# Altium schematic sheet [5]Motor_Driver.SchDoc
size A3; DocumentNumber: 5; SheetNumber: 5; SheetTotal: 11
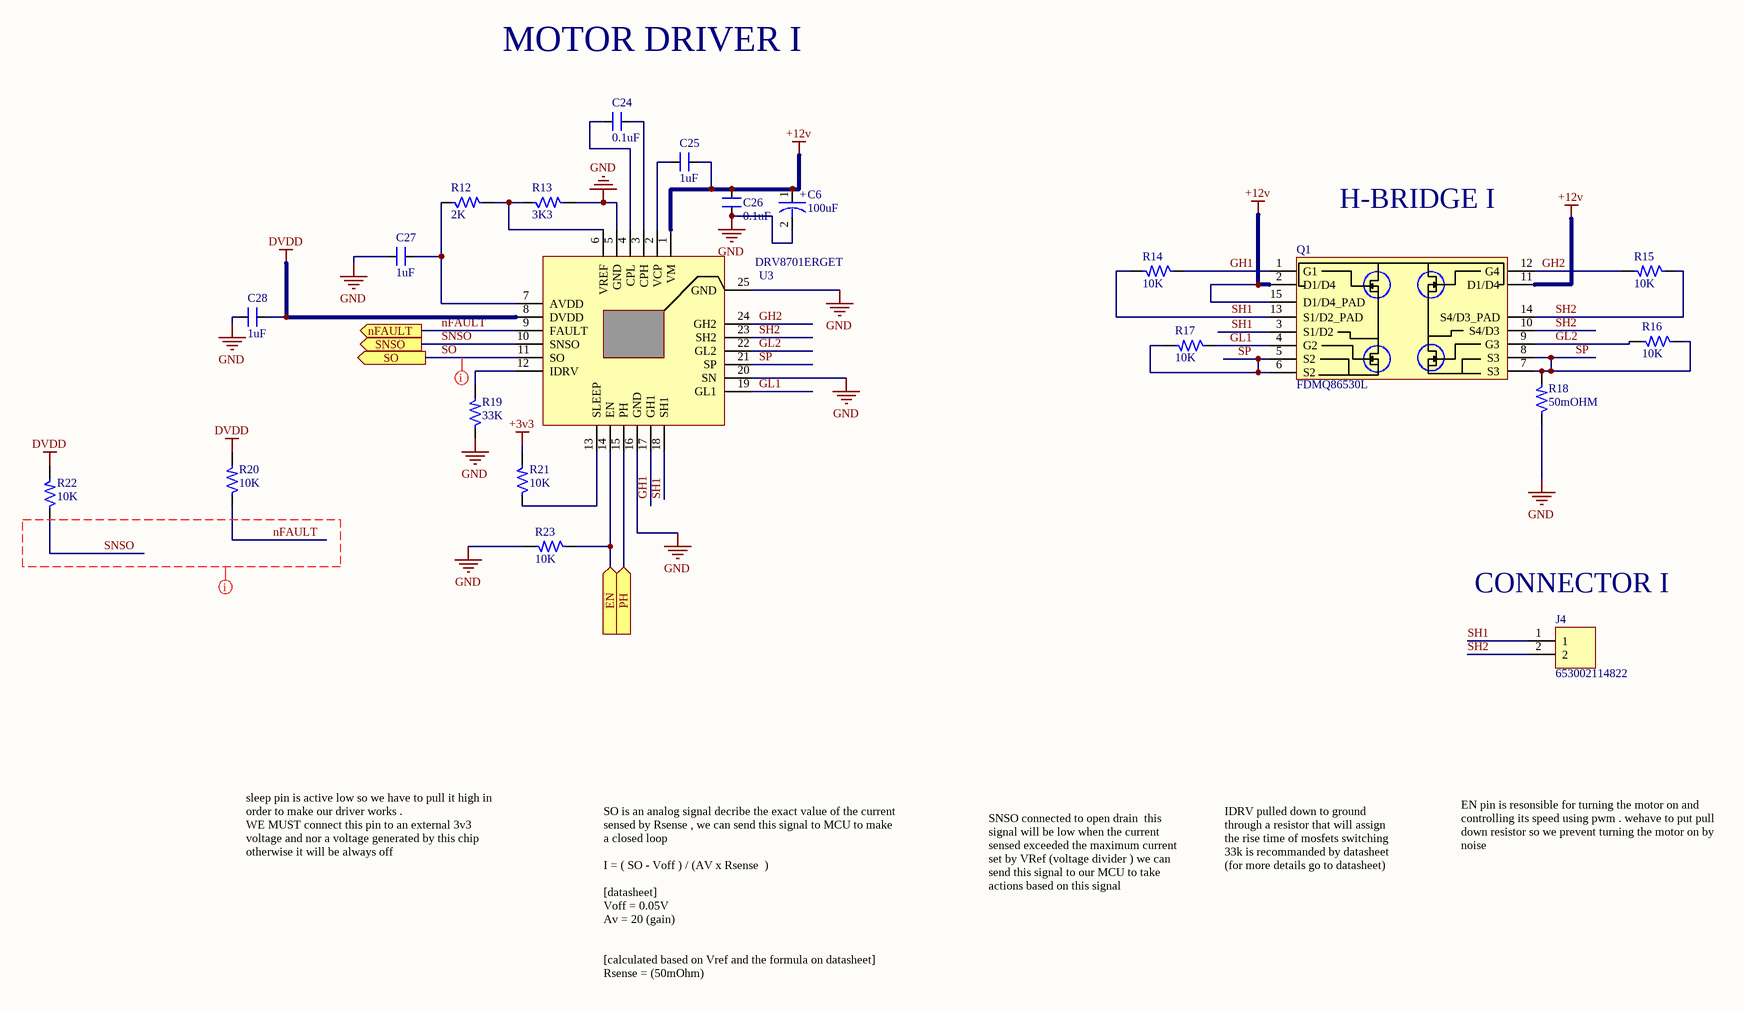
[diagram p0: [5]Motor_Driver.SchDoc]

## Parts
C6  100uF  [ACAP_P305_D393_H393_RAD]
C24  0.1uF  [CAP_0805]
C25  1uF  [CAP_0805]
C26  0.1uF  [CAP_0805]
C27  1uF  [CAP_0805]
C28  1uF  [CAP_0805]
J4  653002114822  [CON2_50_653002114822_TH_ST]
Q1  FDMQ86530L  [DFN5045-12_33_212_27X15_SMD_1]
R12  2K  [RES_0805]
R13  3K3  [RES_0603]
R14  10K  [RES_0805]
R15  10K  [RES_0805]
R16  10K  [RES_0805]
R17  10K  [RES_0805]
R18  50mOHM  [RES_2512]
R19  33K  [RES_0805]
R20  10K  [RES_0805]
R21  10K  [RES_0805]
R22  10K  [RES_0805]
R23  10K  [RES_0805]
U3  DRV8701ERGET  [VFQFN24_19.6_196_12X32_SMD_1]

## Ports
EN (in), nFAULT (out), PH (in), SNSO (out), SO (out)

## Nets
+3v3: R21.2
+12v: C6.1 C25.2 C26.2 Q1.2(D1/D4) Q1.11(D1/D4) Q1.15(D1/D4_PAD) U3.1(VM)
DVDD: C28.2 R20.2 R22.2 U3.8(DVDD)
GND: C6.2 C26.1 C27.1 C28.1 R13.2 R18.1 R19.1 R23.2 U3.5(GND) U3.16(GND) U3.20(SN) U3.25(GND)
EN: R23.1 U3.14(EN) ; port EN
GH1: Q1.1(G1) R14.1 U3.17(GH1)
GH2: Q1.12(G4) R15.2 U3.24(GH2)
GL1: Q1.4(G2) R17.1 U3.19(GL1)
GL2: Q1.9(G3) R16.2 U3.22(GL2)
nFAULT: R20.1 U3.9(FAULT) ; port nFAULT
PH: U3.15(PH) ; port PH
SH1: J4.1 Q1.3(S1/D2) Q1.13(S1/D2_PAD) R14.2 U3.18(SH1)
SH2: J4.2 Q1.10(S4/D3) Q1.14(S4/D3_PAD) R15.1 U3.23(SH2)
SNSO: R22.1 U3.10(SNSO) ; port SNSO
SO: U3.11(SO) ; port SO
SP: Q1.5(S2) Q1.6(S2) Q1.7(S3) Q1.8(S3) R16.1 R17.2 R18.2 U3.21(SP)
NetC24_1: C24.1 U3.4(CPL)
NetC24_2: C24.2 U3.3(CPH)
NetC25_1: C25.1 U3.2(VCP)
NetC27_2: C27.2 R12.1 U3.7(AVDD)
NetR12_2: R12.2 R13.1 U3.6(VREF)
NetR19_2: R19.2 U3.12(IDRV)
NetR21_1: R21.1 U3.13(SLEEP)

## Layout directives
net class Critical nets: nFAULT, SNSO, SO

## Notes on the sheet
- MOTOR DRIVER I
- H-BRIDGE I
- (near J4) CONNECTOR I
- sleep pin is active low so we have to pull it high in order to make our driver works .
  WE MUST connect this pin to an external 3v3 voltage and nor a voltage generated by this chip otherwise it will be always off
- SNSO connected to open drain  this signal will be low when the current sensed exceeded the maximum current set by VRef (voltage divider ) we can send this signal to our MCU to take actions based on this signal
- IDRV pulled down to ground through a resistor that will assign the rise time of mosfets switching
  33k is recommanded by datasheet
  (for more details go to datasheet)
- EN pin is resonsible for turning the motor on and controlling its speed using pwm . wehave to put pull down resistor so we prevent turning the motor on by noise
- SO is an analog signal decribe the exact value of the current  sensed by Rsense , we can send this signal to MCU to make a closed loop
  I = ( SO - Voff ) / (AV x Rsense  )
  [datasheet]
  Voff = 0.05V
  Av = 20 (gain)
  [calculated based on Vref and the formula on datasheet]
  Rsense = (50mOhm)
- Title
- Size:
- Date:
- A3
- Number:
- Time:
- Revision:
- Sheet
- of
- File:
- (in symbol CAP-P_100uF-50V-20%-RAD) +

## Library data of the parts
C6 = CAP-P_100uF-50V-20%-RAD: 100µF 50V Aluminum Polymer Capacitor Radial, Can - SMD 28mOhm 4000 Hrs @ 125°C /; Manufacturer: Nichicon; Manufacturer Part Number: GYA1H101MCQ1GS; Alternate Part Number-1: VEU101M1HTR-1010; Case/Package: Radial-SMD; Supplier-1: SP ROAD; Supplier Part Number-1: GYA1H101MCQ1GS
C24 C26 = CAP_0.1uF-50V-5%-0805: 0.1µF ±5% 50V Ceramic Capacitor X7R 0805 (2012 Metric) /; Manufacturer: AVX Corporation; Manufacturer Part Number: 08055C104JAT4A; Alternate Part Number-1: 0805B104M500; Case/Package: 0805; Supplier-1: SIRICOM; Supplier Part Number-1: 0805B104J500CT
C25 C27 C28 = CAP_1uF-50V-5%-0805: 1µF ±5% 50V Ceramic Capacitor X7R 0805 (2012 Metric) /; Manufacturer: Samsung; Manufacturer Part Number: CC0805JKX7R9BB105; Alternate Part Number-1: 0805F105M500NT; Case/Package: 0805; Supplier-1: SIRICOM; Supplier Part Number-1: CL21B105KBFNNNE
J4 = CON-PLG_2X1-50-ST-TH: 2 Pins, 1 Row 1.25mm Pitch, Straight Connector, male; Manufacturer: JST; Mating Part Number: 653002113322; Crimp Part Number: 653153128130; Alternate Part Number-1: NA; Manufacturer Part Number: 653002114822; Case/Package: TH-CON; Supplier-1: WURTH; Supplier Part Number-1: 653002114822
Q1 = MOSFET-N_60V-8A-V-DFN5045-12: Mosfet Array 4 N-Channel 8A (Ta) Surface Mount V-DFN5045-12; Manufacturer: ON Semiconductor; Alternate Part Number-1: NA; Manufacturer Part Number: FDMQ86530L; Case/Package: DFN5045-12; Supplier-1: Arrow; Supplier Part Number-1: FDMQ86530L
R12 = RES_2K-0.125W-1%-0805: 2 kOhms ±1% 0.125W, 1/8W Chip Resistor 0805 (2012 Metric) Moisture Resistant Thick Film /; Manufacturer: TE Connectivity; Manufacturer Part Number: RC0805FR-072KL; Alternate Part Number-1: NA; Case/Package: 0805; Supplier-1: SIRICOM; Supplier Part Number-1: WR08X2001FTL
R13 = RES_3.3K-0.1W-1%-0603: 3.3 kOhms ±1% 0.1W, 1/10W Chip Resistor 0603 (1608 Metric) Automotive AEC-Q200 Thick Film /; Manufacturer: Wilson; Manufacturer Part Number: WR06X3301FTL; Alternate Part Number-1: 0603WAF3301T5E; Case/Package: 0603; Supplier-1: SIRICOM; Supplier Part Number-1: WR06X3301FTL
R14-R17 R20-R23 = RES_10K-0.125W-1%-0805: 10 kOhms ±1% 0.125W, 1/8W Chip Resistor 0805 (2012 Metric) Automotive AEC-Q200 Thick Film /; Manufacturer: CTS; Manufacturer Part Number: WR08X1002FTL; Case/Package: 0805; Supplier-1: SIRICOM; Supplier Part Number-1: WR08X1002FTL; Alternate Part Number-1: WR08X1002FTL
R18 = RES_50mOhm-2W-1%-2512: 50 mOhms ±1% 2W Chip Resistor 2512 (6432 Metric) Automotive AEC-Q200, Current Sense, Moisture Resistant Metal Element /; Manufacturer: Yageo; Manufacturer Part Number: PA2512FKF7W0R05E; Alternate Part Number-1: PMR100HZPFU5L00; Case/Package: 2512; Supplier-1: SIRICOM; Supplier Part Number-1: LR2512-22R060F1
R19 = RES_33K-0.125W-1%-0805: Thick Film Resistors - SMD 33KOhms 1/8W 150V33 kOhms ±1% 0.125W, 1/8W Chip Resistor 0805 (2012 Metric) Thick Film /; Manufacturer: Vishay BCcomponents; Manufacturer Part Number: CRG0805F33K; Alternate Part Number-1: NA; Case/Package: 0805; Supplier-1: SIRICOM; Supplier Part Number-1: WR08X3302FTL
U3 = IC_DRV8701ERGET: Motor Driver Power MOSFET Parallel 24-VQFN (4x4); Manufacturer: Texas Instruments; Alternate Part Number-1: NA; Manufacturer Part Number: DRV8701ERGET; Case/Package: VFQFN24; Supplier-1: ARROW; Supplier Part Number-1: DRV8701ERGET